# Altium schematic sheet Manual Override.SchDoc
size A; SheetNumber: 8; SheetTotal: 11
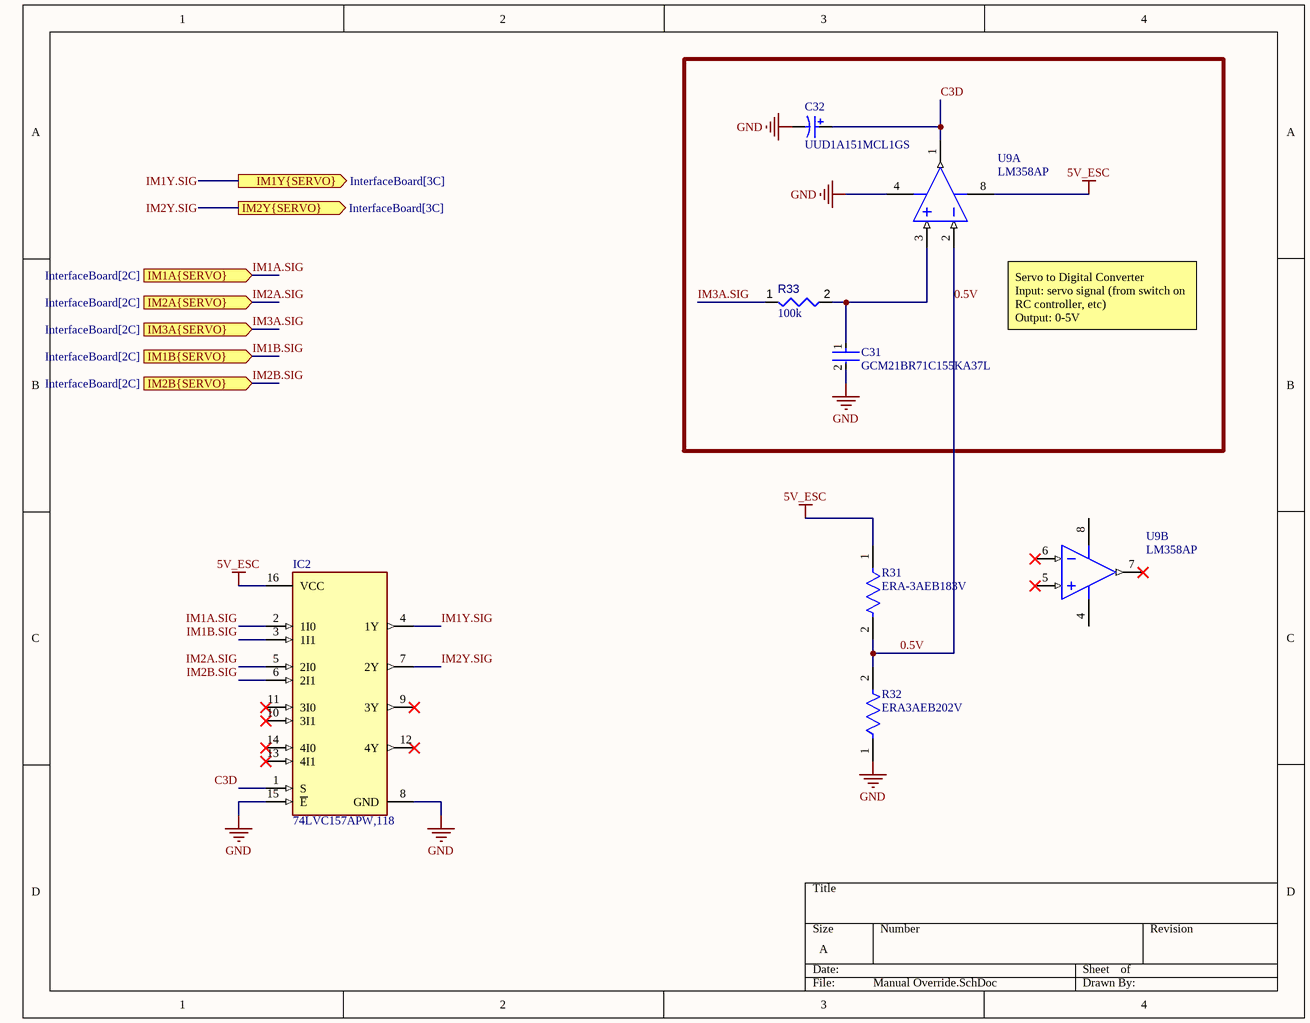
[diagram p0: Manual Override.SchDoc]

## Parts
C31  GCM21BR71C155KA37L  [FP-GCM21B-0_15-IPC_B]
C32  UUD1A151MCL1GS  [NIC-CAPA2-6.3X5.8_V]
IC2  74LVC157APW,118  [FP-SOT403-1-IPC_B]
R31  ERA-3AEB183V  [FP-ERA3A-IPC_A]
R32  ERA3AEB202V  [FP-ERA3A-IPC_C]
R33  value 100k  [RESC1608X55X25ML10T15]  (hidden comment: Resistor 100k +/-1% 0603 100 mW)
U9  LM358AP  [P0008A]  (parts A,B of 2)

## Ports
IM1A{SERVO} (in, see InterfaceBoard[2C]), IM1B{SERVO} (in, see InterfaceBoard[2C]), IM1Y{SERVO} (out, see InterfaceBoard[3C]), IM2A{SERVO} (in, see InterfaceBoard[2C]), IM2B{SERVO} (in, see InterfaceBoard[2C]), IM2Y{SERVO} (out, see InterfaceBoard[3C]), IM3A{SERVO} (in, see InterfaceBoard[2C])

## Nets
5V_ESC: IC2.16(VCC) R31.1 U9.8(VCC)
GND: C31.2 C32.2 IC2.8(GND) IC2.15(~{E}) R32.1 U9.4(GND)
0.5V: R31.2 R32.2 U9.2(1IN-)
C3D: C32.1 IC2.1(S) U9.1(1OUT)
IM1A.SIG: IC2.2(1I0) ; port IM1A{SERVO}
IM1B.SIG: IC2.3(1I1) ; port IM1B{SERVO}
IM1Y.SIG: IC2.4(1Y) ; port IM1Y{SERVO}
IM2A.SIG: IC2.5(2I0) ; port IM2A{SERVO}
IM2B.SIG: IC2.6(2I1) ; port IM2B{SERVO}
IM2Y.SIG: IC2.7(2Y) ; port IM2Y{SERVO}
IM3A.SIG: R33.1 ; port IM3A{SERVO}
NetC31_1: C31.1 R33.2 U9.3(1IN+)

Not connected (* = marked no-connect by the designer): IC2 9(3Y)* 10(3I1)* 11(3I0)* 12(4Y)* 13(4I1)* 14(4I0)*; U9 5(2IN+)* 6(2IN-)* 7(2OUT)*

## Notes on the sheet
- Servo to Digital Converter
  Input: servo signal (from switch on RC controller, etc)
  Output: 0-5V
  The DPDT DIP switch (76SD01T) allows for changing the polarity

## Library data of the parts
C31 = CMP-2007-03337-2: Ceramic Capacitor for Automotive 1.5uF ±10% 16VDC X7R 0805 Embossed T/R; Voltage Rating: 16V; Case Code (Metric): 2012; Length: 2mm; Package Quantity: 3000; Width: 0.049inch; Min Operating Temperature: -55°C; Depth: 1.25mm; Capacitance: 1.5uF; Radiation Hardening: No; Packaging: Tape and Reel; Max Operating Temperature: 125°C; Ratings: AEC-Q200; Case Code (Imperial): 0805; Dielectric: X7R; Mount: Surface Mount; Tolerance: 10%; Thickness: 0.055inch; Height: 1.25mm; Case/Package: 0805; Voltage Rating (DC): 16V; Termination: SMD/SMT
C32 = CMP-0687-00052-1: Aluminum Electrolytic Capacitor, UD Series, Low Impedance, 150 uF, 10 V, + / - 20%, -55 to 105 degC, Chip Type, 6.3 x 5.8 mm D x L, Pb-Free, Reel; Manufacturer: Nichicon; Tolerance Rated Capacitance: -20 to 20%; Endurance Time: 2000 h; Rated Voltage: 10 V; Impedance: 0.44 Ohm; Rated Capacitance: 150 uF; Rated Ripple Current (at 100kHz): 230 mA; Packing: Dia382mm Reel; RoHS: TRUE; ComponentLink1URL: http://www.nichicon.co.jp/; Mounting Technology: Surface Mount; Length: 5.8 mm; ComponentLink3URL: http://products.nichicon.co.jp/en/pdf/XJA043/e-ud.pdf; ComponentLink1Description: Manufacturer URL; ComponentLink2URL: http://products.nichicon.co.jp/en/pdf/XJA043/e-ud.pdf; DatasheetVersion: 08/2012; ComponentLink3Description: Package Specification; ComponentLink2Description: Datasheet; PartNumber: UUD1A151MCL1GS; Diameter: 6.3 mm; PackageDescription: 2-Pin Surface Mount Device, Diameter 6.3 mm, Height 5.8 mm, Pitch 5.4 mm; PackageReference: CAPAE-D6.3H5.8
IC2 = CMP-14348-000002-1: IC QUAD 2-IN MUX 16-TSSOP
R31 = CMP-2000-00938-2: RES SMD 18K OHM 0.1% 1/10W 0603; Power Rating: 100mW; Voltage Rating: 75V; Temperature Coefficient: 25ppm/°C; Resistance: 18kR; Military Standard: Not; Resistance Tolerance: 0.1%; Width: 0.8mm; Number of Terminations: 2; Max Operating Temperature: 155°C; Length: 1.6mm; REACH SVHC: No SVHC; Technology: METAL FILM; Min Operating Temperature: -55°C; Case/Package: 0603; Size Code: 0603; Lead Free: Lead Free; Number of Pins: 2; Features: Automotive AEC-Q200; Series: ERA-3A; Resistor Type: Thin Film; Contact Plating: Tin; Case Code (Metric): 1608; Termination: SMD/SMT; Mount: Surface Mount; Height: 0.45mm; Tolerance: 0.1%; Max Power Dissipation: 100mW; Case Code (Imperial): 0603; Depth: 0.8mm; Construction: Rectangular; Package Quantity: 1; Packaging: Tape and Reel; RoHS Compliant: Yes; Voltage Rating (DC): 75V; Radiation Hardening: No
R32 = CMP-2000-00945-2: RES SMD 2K OHM 0.1% 1/10W 0603; Resistance: 2kR; Max Power Dissipation: 100mW; Voltage Rating (DC): 75V; Temperature Coefficient: 25ppm/°C; REACH SVHC: No SVHC; Number of Terminations: 2; RoHS Compliant: Yes; Case Code (Metric): 1608; Package Quantity: 5000; Width: 0.8mm; Mount: Surface Mount; Series: ERA-3A; Number of Pins: 2; Height: 0.45mm; Military Standard: Not; Packaging: Tape and Reel; Resistor Type: Thin Film; Lead Free: Lead Free; Construction: Rectangular; Max Operating Temperature: 155°C; Contact Plating: Tin; Termination: SMD/SMT; Technology: THIN FILM; Length: 1.6mm; Power Rating: 100mW; Resistance Tolerance: 0.1%; Working Voltage: 75V; Voltage Rating: 75V; Depth: 0.8mm; Case Code (Imperial): 0603; Radiation Hardening: No; Case/Package: 0603; Tolerance: 0.1%; Min Operating Temperature: -55°C
R33 = CMP-009-00023-5: Chip Resistor, 100 KOhm, +/- 1%, 0.1 W, -55 to 155 degC, 0603 (1608 Metric); Voltage Rating: 50V; Power: 100mW; Max Operating Temperature: 155°C; RoHS Compliant: True; Tolerance: 1%; Pins: 2; Case/Package: 0603; Mounting Technology: SM; Min Operating Temperature: -55°C
U9 = CMP-1685-00017-1: Dual Operational Amplifier, 3 to 32 V, 0 to 70 degC, 8-Pin PDIP (P), Pb-Free (RoHS), Tube; Case\Package: 0603; Luminous Intensity: 90 mcd; Viewing Angle: 130 degrees; Nominal Vf: 2 V; Lens Style: Diffused; Illumination Colour: Orange; Power Rating: 75 mW; Forward Current: 20 mA; Pins: 2; ComponentLink3Description: Package Specification; Packaging: Tape and Reel; Mount: Surface Mount; PackageReference: P0008A; Radiation Hardening: No; ComponentLink3URL: http://www.ti.com/lit/ml/mpdi001b/mpdi001b.pdf; Case Code (Metric): 1608; ComponentLink2Description: Datasheet; Max Operating Temperature: 85 degC; ComponentLink1Description: Manufacturer URL; RoHSCompliant: true; Width: 0.8 mm; Length: 1.6 mm; DatasheetVersion: SLOS068T, 04/2015; Min Operating Temperature: -55 degC; Height: 1.1 mm; Colour: Orange; ComponentLink2URL: http://www.ti.com/lit/ds/symlink/lm358a.pdf; PackageDescription: 8-Pin Double In-line Package, Body 9.59 x 6.35 mm, Pitch 2.54 mm; PackageVersion: 4040082/E, 04/2010; Forward Voltage: 2 V; Package Quantity: 3000; Case Code (Imperial): 0603; ComponentLink1URL: http://www.ti.com/